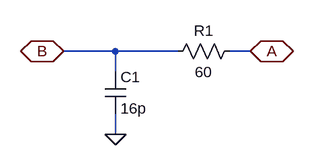
[diagram p0: schematic cross_point.asc]
cross_point.asc, the LTspice schematic file:
Version 4
SHEET 1 880 680
WIRE 80 160 0 160
WIRE 176 160 80 160
WIRE 288 160 256 160
WIRE 80 192 80 160
WIRE 80 288 80 256
FLAG 288 160 A
IOPIN 288 160 BiDir
FLAG 0 160 B
IOPIN 0 160 BiDir
FLAG 80 288 0
SYMBOL res 272 144 R90
WINDOW 0 0 56 VBottom 2
WINDOW 3 32 56 VTop 2
SYMATTR InstName R1
SYMATTR Value 60
SYMBOL cap 64 192 R0
SYMATTR InstName C1
SYMATTR Value 16p

The netlist it stands for:
* cross_point.asc
R1 A B 60
C1 B 0 16p
.backanno
.end